# EAGLE design Tester Schematic (EAGLE 8.6.0)
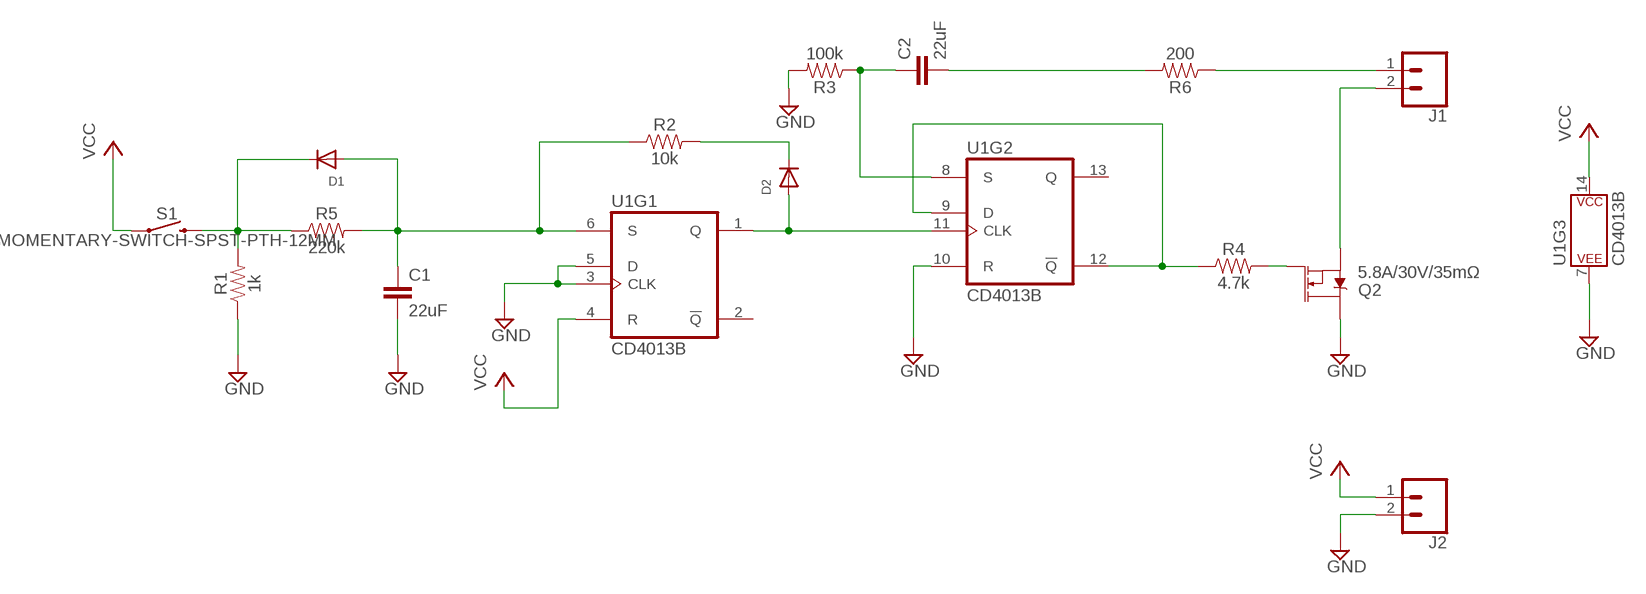
[diagram p0: schematic, sheet 1]

## Parts
C1  22uF  22UF-0805-6.3V-20%  [0805]
C2  22uF  22UF-0805-6.3V-20%  [0805]
D1  DIODESOD-123  [SOD-123]
D2  DIODESOD-123  [SOD-123]
J1  CONN_02  [1X02]
J2  CONN_02  [1X02]
Q2  5.8A/30V/35mΩ  MOSFET-NCH-AO3404A  [SOT23-3]
R1  1k  1KOHM-0603-1/10W-1%  [0603]
R2  10k  10KOHM-0603-1/10W-1%  [0603]
R3  100k  100KOHM-0603-1/10W-1%  [0603]
R4  4.7k  4.7KOHM-0603-1/10W-1%  [0603]
R5  220k  220KOHM-0603-1/10W-1%  [0603]
R6  200  200OHM-0603-1/10W-1%  [0603]
S1  MOMENTARY-SWITCH-SPST-PTH-12MM  [TACTILE_SWITCH_PTH_12MM]
U1  CD4013B  CD4013  [DIP14-KIT]

## Nets
GND: C1.2 J2.2 Q2.3(D) R1.1 R3.2 U1.3(CLK) U1.5(D) U1.7(P$V-) U1.10(R)
N$1: C1.1 D1.A R2.1 R5.2 U1.6(S)
N$2: D1.C R1.2 R5.1 S1.3
N$3: R4.1 U1.9(D) U1.12(!Q)
N$4: D2.A U1.1(Q) U1.11(CLK)
N$5: D2.C R2.2
N$6: C2.1 R3.1 U1.8(S)
N$8: Q2.1(G) R4.2
N$9: J1.2 Q2.2(S)
N$10: C2.2 R6.2
N$11: J1.1 R6.1
VCC: J2.1 S1.1 U1.4(R) U1.14(P$V+)
Unconnected: U1.2(!Q) U1.13(Q)

## Library data of the parts
C1 C2 = SparkFun-Capacitors:22UF: 22µF ceramic capacitors A capacitor is a passive two-terminal electrical component used to store electrical energy temporarily in an electric field.; PROD_ID: CAP-08402
D1 D2 = adafruit:DIODE: Diode SMADIODE - SMA Surface Mount Package 20V 1A Schottky Diode Digikey: 641-1014-6-ND DO-1N4148 - Through Hole Small Current Diode SOD-123 20V 1 A (.5mV Vf) Schottky Diode - Digikey: MBRX120TPMSCT-ND SOD-323 10V 570mA (.38mV Vf, 3ns) Schottky Diode - Digikey: ZLLS410CT-ND SOD-523 30V 30mA Schottky Diode (RB751S-40TE61) - Digikey: RB751S-40TE61CT-ND SOT23-R/W - SOT23 Package (R = Solder Paste/Reflow Ovens, W = Hand-Soldering) BAT54Film 40V 300mA - Digikey: 497-7162-1-ND
J1 J2 = SparkFun-Connectors:CONN_02: Multi connection point. Often used as Generic Header-pin footprint for 0.1 inch spaced/style header connections On any of the 0.1 inch spaced packages, you can populate with these: Break Away Headers - Straight <https://www.sparkfun.com/products/116> (PRT-00116) Break Away Male Headers - Right Angle <https://www.sparkfun.com/products/553> (PRT-00553) Female Headers <https://www.sparkfun.com/products/115> (PRT-00115) Break Away Headers - Machine Pin <https://www.sparkfun.com/products/117> (PRT-00117) Break Away Female Headers - Swiss Machine Pin <https://www.sparkfun.com/products/743> (PRT-00743) For SCREWTERMINALS and SPRING TERMINALS visit here: Screw Terimnals on SparkFun.com <https://www.sparkfun.com/search/results?term=Screw+Terminals> (5mm/3.5mm/2.54mm spacing) This device is also useful as a general connection point to wire up your design to another part of your project. Our various solder wires solder well into these plated through hole pads. Hook-Up Wire - Assortment (Stranded, 22 AWG) <https://www.sparkfun.com/products/11375> (PRT-11375) Hook-Up Wire - Assortment (Solid Core, 22 AWG) <https://www.sparkfun.com/products/11367> (PRT-11367) View the entire wire category on our website here <https://www.sparkfun.com/categories/141> Special notes: Molex polarized connector foot print use with: PRT-08233 with associated crimp pins and housings. 2.54_SCREWTERM for use with PRT-10571. 3.5mm Screw Terminal footprints for PRT-08084 5mm Screw Terminal footprints for use with PRT-08432
Q2 = SparkFun-DiscreteSemi:MOSFET-NCH: N-channel MOSFETs Voltage controlled devices that allow control of high current outputs. SparkFun Products: SparkFun OpenScale <https://www.sparkfun.com/products/13261> SparkFun Digital Sandbox <https://www.sparkfun.com/products/12651> SparkFun Monster Moto Shield <https://www.sparkfun.com/products/10182> SparkFun MOSFET Power Controller <https://www.sparkfun.com/products/11214>; PROD_ID: TRANS-12988
R1 = SparkFun-Resistors:1KOHM: 1kΩ resistor A resistor is a passive two-terminal electrical component that implements electrical resistance as a circuit element. Resistors act to reduce current flow, and, at the same time, act to lower voltage levels within circuits. - Wikipedia; PROD_ID: RES-07856
R2 = SparkFun-Resistors:10KOHM: 10kΩ resistor A resistor is a passive two-terminal electrical component that implements electrical resistance as a circuit element. Resistors act to reduce current flow, and, at the same time, act to lower voltage levels within circuits. - Wikipedia; PROD_ID: RES-00824
R3 = SparkFun-Resistors:100KOHM: 100kΩ resistor A resistor is a passive two-terminal electrical component that implements electrical resistance as a circuit element. Resistors act to reduce current flow, and, at the same time, act to lower voltage levels within circuits. - Wikipedia; PROD_ID: RES-07828
R4 = SparkFun-Resistors:4.7KOHM: 4.7kΩ resistor A resistor is a passive two-terminal electrical component that implements electrical resistance as a circuit element. Resistors act to reduce current flow, and, at the same time, act to lower voltage levels within circuits. - Wikipedia; PROD_ID: RES-07857
R5 = SparkFun-Resistors:220KOHM: 220kΩ resistor A resistor is a passive two-terminal electrical component that implements electrical resistance as a circuit element. Resistors act to reduce current flow, and, at the same time, act to lower voltage levels within circuits. - Wikipedia; PROD_ID: RES-08969
R6 = SparkFun-Resistors:200OHM: 200Ω resistor A resistor is a passive two-terminal electrical component that implements electrical resistance as a circuit element. Resistors act to reduce current flow, and, at the same time, act to lower voltage levels within circuits. - Wikipedia; PROD_ID: RES-08220
S1 = SparkFun-Switches:MOMENTARY-SWITCH-SPST: Momentary Switch (Pushbutton) - SPST Normally-open (NO) SPST momentary switches (buttons, pushbuttons). Variants PTH-12MM - 12mm square, through-hole Momentary Pushbutton Switch - 12mm Square <https://www.sparkfun.com/products/9190> (COM-09190) PTH-6.0MM, PTH-6.0MM-KIT - 6.0mm square, through-hole Mini Pushbutton Switch <https://www.sparkfun.com/products/97> (COM-00097) KIT package intended for soldering kit's - only one side of pads' copper is exposed. PTH-RIGHT-ANGLE-KIT - Right-angle, through-hole Right Angle Tactile Button <https://www.sparkfun.com/products/10791> - Used on SparkFun BigTime Watch Kit <https://www.sparkfun.com/products/11734> SMD-12MM - 12mm square, surface-mount Tactile Button - SMD (12mm) <https://www.sparkfun.com/products/12993> (COM-12993) Used on SparkFun PicoBoard <https://www.sparkfun.com/products/11888> SMD-4.5MM - 4.5mm Square Trackball Switch Used on SparkFun Blackberry Trackballer Breakout <https://www.sparkfun.com/products/13169> SMD-4.6MMX2.8MM - 4.60mm x 2.80mm, surface mount Used on SparkFun SAMD21 Mini Breakout <https://www.sparkfun.com/products/13664> SMD-5.2MM, SMD-5.2-REDUNDANT - 5.2mm square, surface-mount Mini Pushbutton Switch - SMD <https://www.sparkfun.com/products/8720> (COM-08720) Used on Arduino Pro Mini <https://www.sparkfun.com/products/11114> REDUNDANT package connects both switch circuits together SMD-6.0X3.5MM - 6.0 x 3.5mm, surface mount Momentary Reset Switch SMD <https://www.sparkfun.com/products/8229> (COM-08229) SMD-6.2MM-TALL - 6.2mm square, surface mount Tactile Button - SMD (6mm) <https://www.sparkfun.com/products/12992> Used on SparkFun Digital Sandbox <https://www.sparkfun.com/products/12651> SMD-RIGHT-ANGLE - Right-angle, surface mount Used on SparkFun Block for Intel® Edison - Arduino <https://www.sparkfun.com/products/13036>; PROD_ID: SWCH-09185; SF_SKU: COM-09190
U1 = SparkFun-IC-Logic:CD4013: Dual D-type Flip-Flop Datasheet <https://cdn.sparkfun.com/datasheets/Kits/CD4013B.pdf> SparkFun Products SparkFun SparkPunk Sound Kit <https://www.sparkfun.com/products/11177> (KIT-11177) SparkFun SparkPunk Sequencer Kit <https://www.sparkfun.com/products/12707> (KIT-12707); PROD_ID: IC-11896

## Net classes
0 default: width 0.305 mm, drill 0.508 mm, clearance 0.254 mm

## Board
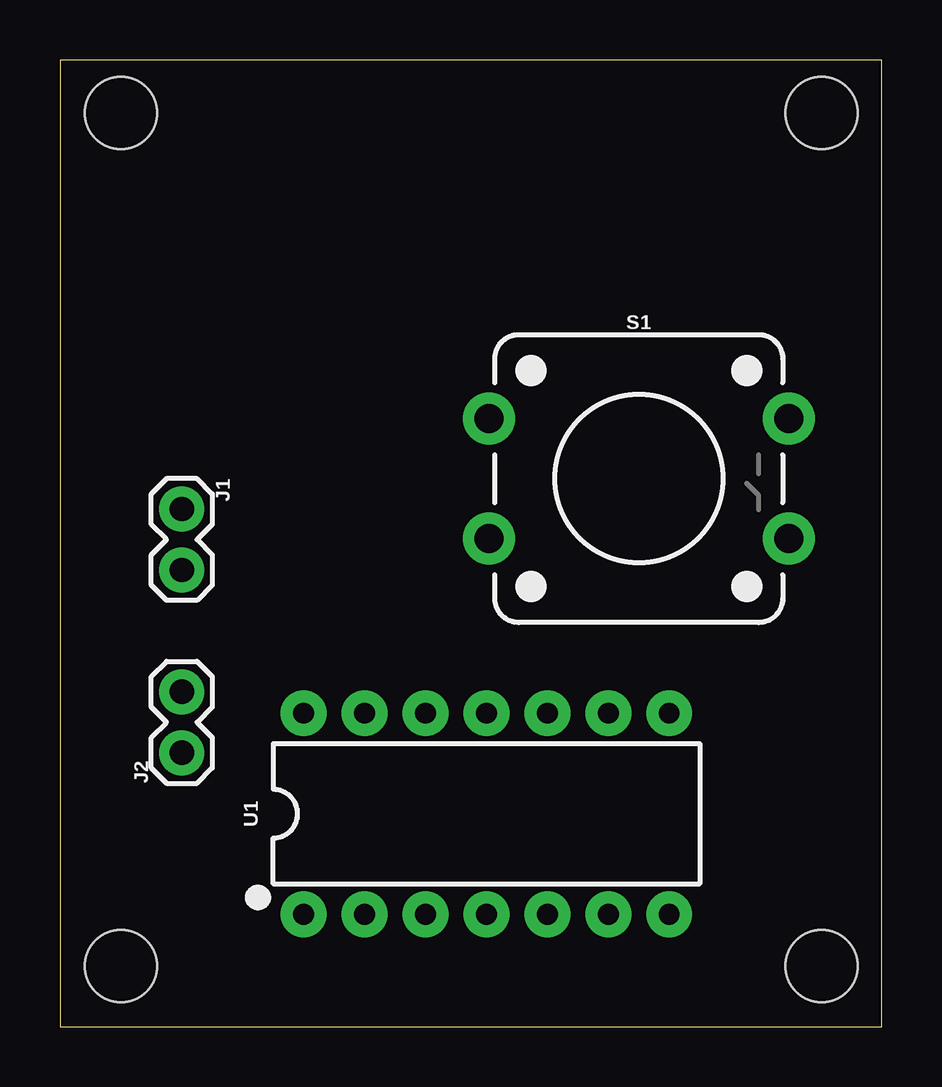
[diagram p1: board, top side]
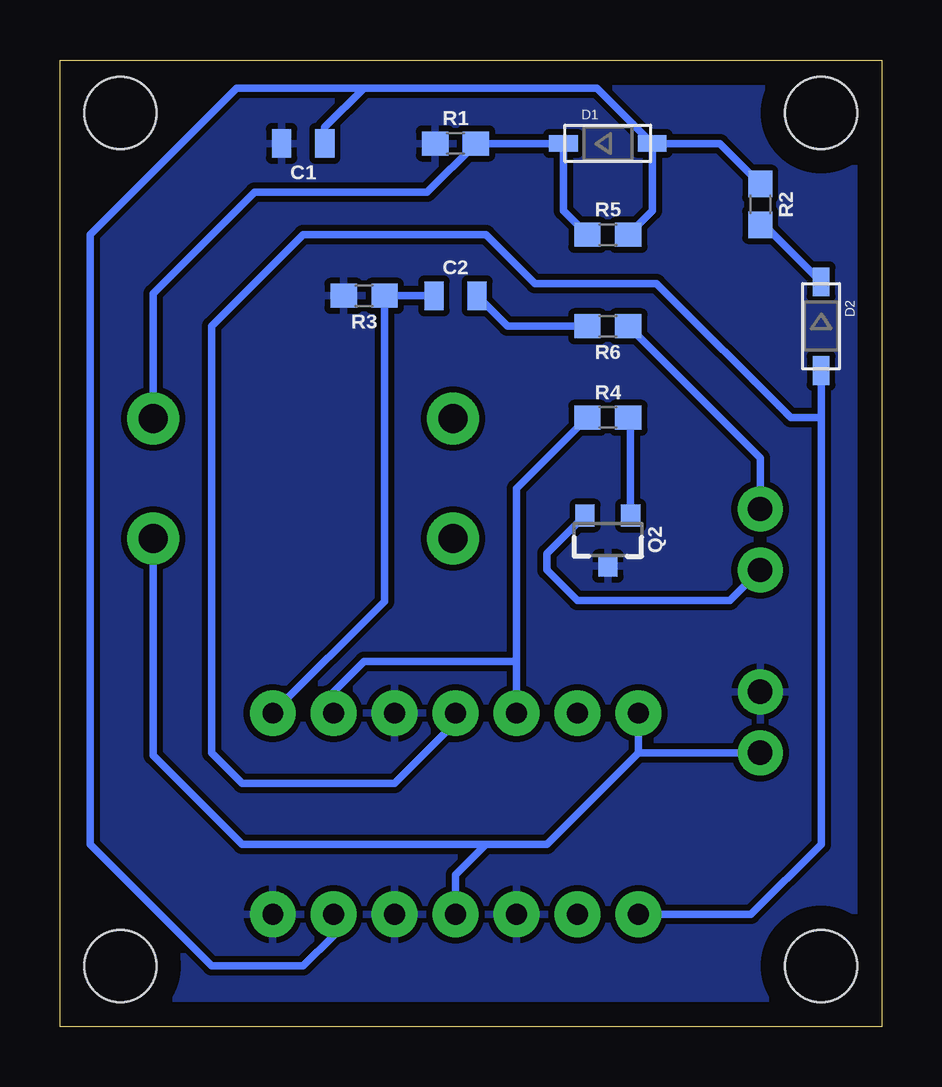
[diagram p2: board, bottom side, seen from below]

Size 34.27 x 40.31 mm. Coordinates in mm from the lower left corner, seen from the top.
Outline: 0,0 34.27,0 34.27,40.31 0,40.31 0,0
Copper layers (1*16): Top 0.035mm / dielectric 1.5mm / Bottom 0.035mm
Design rules "default": minimum track width 6mil, minimum drill 0.35mm, track to track 6mil, track to pad 6mil, pad to pad 6mil, via to via 6mil, smd to smd 6mil, copper to edge 40mil, drill to drill 6mil, minimum pad ring 10mil, minimum via ring 8mil, stop-mask expansion 4mil, vias tented up to drill 0mil, thermal gap 10mil
Holes 3 mm at 2.54,38.1 31.75,38.1 2.54,2.54 31.75,2.54

### Footprints (pad centres in the part's own frame; a part is rotated, then mirrored left to right if it is on the bottom)
0805 = smd 0.8 x 1.2: 1 -0.9,0; 2 0.9,0
SOD-123 = smd 1.2 x 0.7: A 1.85,0; C -1.85,0
1X02 = drill 1.016 pad 1.88: 1 0,0; 2 2.54,0
SOT23-3 = smd 0.8 x 0.9: 1 -0.95,-1; 2 0.95,-1; 3 0,1.1
0603 = smd 1.1 x 1: 1 -0.85,0; 2 0.85,0
TACTILE_SWITCH_PTH_12MM = drill 1.2 pad 2.159: 1 6.25,-2.5; 2 -6.25,-2.5; 3 6.25,2.5; 4 -6.25,2.5
DIP14-KIT = drill 0.864 pad 1.905: 1 -8.89,-4.191; 2 -6.35,-4.191; 3 -3.81,-4.191; 4 -1.27,-4.191; 5 1.27,-4.191; 6 3.81,-4.191; 7 6.35,-4.191; 8 6.35,4.191; 9 3.81,4.191; 10 1.27,4.191; 11 -1.27,4.191; 12 -3.81,4.191; 13 -6.35,4.191; 14 -8.89,4.191

### Placement (x,y rotation side)
C1  24.13,36.83 180 bottom
C2  17.78,30.48 0 bottom
D1  11.43,36.83 0 bottom
D2  2.54,29.21 270 bottom
J1  5.08,21.59 270 top
J2  5.08,11.43 90 top
Q2  11.43,20.32 180 bottom
R1  17.78,36.83 0 bottom
R2  5.08,34.29 270 bottom
R3  21.59,30.48 180 bottom
R4  11.43,25.4 0 bottom
R5  11.43,33.02 0 bottom
R6  11.43,29.21 180 bottom
S1  24.13,22.86 0 top
U1  19.05,8.89 0 top

### Tracks (layer width: path | path; a pad name or v marks a point on that pad's centre or on a via)
GND
  pour Bottom: -1.27,40.64 -1.27,-1.27 33.02,-1.27 33.02,40.64
N$1
  Bottom 0.305: R2.1 6.77,36.83 D1.A | D1.A 9.58,34.02 R5.2 | D1.A 11.89,39.14 21.59,39.14 | 21.59,39.14 23.23,37.5 C1.1 | U1.6 22.86,3.81 24.13,2.54 25.4,2.54 27.94,2.54 33.02,7.62 33.02,33.02 26.9,39.14 21.59,39.14
N$2
  Bottom 0.305: R5.1 13.28,34.02 D1.C R1.2 18.96,34.8 26.16,34.8 30.38,30.58 S1.3
N$3
  Bottom 0.305: R4.1 15.24,22.44 15.24,15.24 | 15.24,15.24 U1.12 | 15.24,15.24 21.59,15.24 22.86,13.97 U1.9
N$4
  Bottom 0.305: U1.1 5.46,4.7 2.54,7.62 2.54,25.4 | 2.54,25.4 D2.A | 2.54,25.4 3.81,25.4 9.4,30.99 14.48,30.99 16.51,33.02 24.13,33.02 27.94,29.21 27.94,11.43 26.67,10.16 20.32,10.16 17.78,12.7 U1.11
N$5
  Bottom 0.305: D2.C 4.92,33.44 R2.2
N$6
  Bottom 0.305: C2.1 R3.1 20.74,17.74 U1.8
N$8
  Bottom 0.305: Q2.1 10.48,25.3 R4.2
N$9
  Bottom 0.305: J1.2 6.35,17.78 12.7,17.78 13.97,19.05 13.97,19.73 Q2.2
N$10
  Bottom 0.305: C2.2 15.61,29.21 R6.2
N$11
  Bottom 0.305: R6.1 5.08,23.71 J1.1
VCC
  Bottom 0.305: U1.4 17.78,6.35 16.51,7.62 | 10.16,11.43 U1.14 | J2.1 10.16,11.43 | 16.51,7.62 13.97,7.62 10.16,11.43 | 16.51,7.62 24.13,7.62 26.67,7.62 30.38,11.33 S1.1